# Altium schematic sheet DB_Panel.SchDoc
size Tabloid; SheetNumber: 1; SheetTotal: 1; Sheet_Name: Insert name in Document Parameters; Size: 11x17
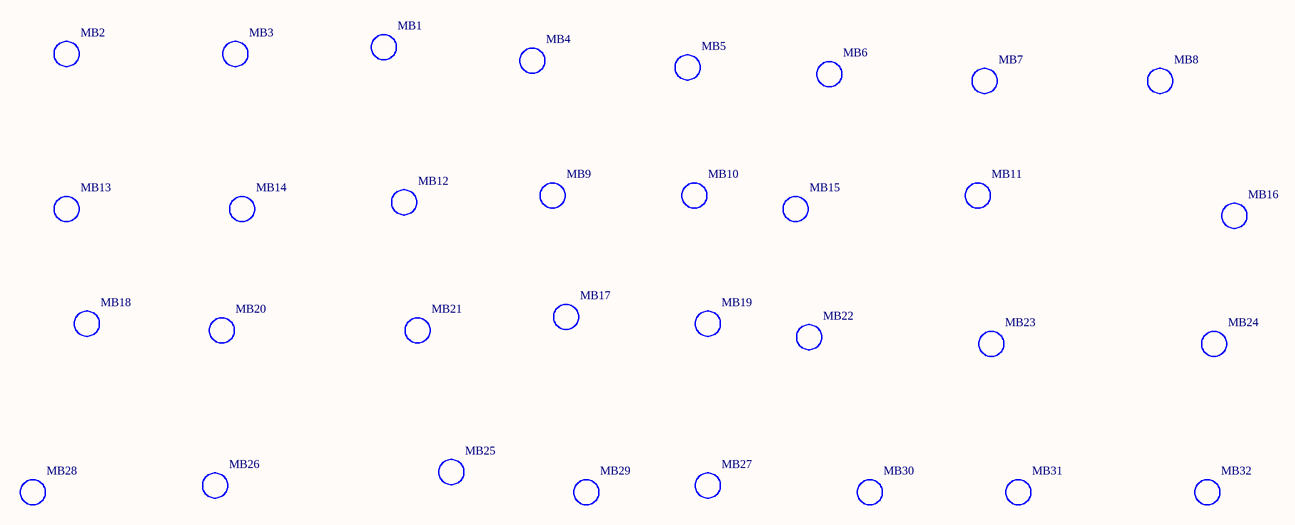
[diagram p0: DB_Panel.SchDoc]

## Parts
MB1  Part Number  [MSBITE_1.6mm]  (value not drawn)
MB2  Part Number  [MSBITE_1.6mm]  (value not drawn)
MB3  Part Number  [MSBITE_1.6mm]  (value not drawn)
MB4  Part Number  [MSBITE_1.6mm]  (value not drawn)
MB5  Part Number  [MSBITE_1.6mm]  (value not drawn)
MB6  Part Number  [MSBITE_1.6mm]  (value not drawn)
MB7  Part Number  [MSBITE_1.6mm]  (value not drawn)
MB8  Part Number  [MSBITE_1.6mm]  (value not drawn)
MB9  Part Number  [MSBITE_1.6mm]  (value not drawn)
MB10  Part Number  [MSBITE_1.6mm]  (value not drawn)
MB11  Part Number  [MSBITE_1.6mm]  (value not drawn)
MB12  Part Number  [MSBITE_1.6mm]  (value not drawn)
MB13  Part Number  [MSBITE_1.6mm]  (value not drawn)
MB14  Part Number  [MSBITE_1.6mm]  (value not drawn)
MB15  Part Number  [MSBITE_1.6mm]  (value not drawn)
MB16  Part Number  [MSBITE_1.6mm]  (value not drawn)
MB17  Part Number  [MSBITE_1.6mm]  (value not drawn)
MB18  Part Number  [MSBITE_1.6mm]  (value not drawn)
MB19  Part Number  [MSBITE_1.6mm]  (value not drawn)
MB20  Part Number  [MSBITE_1.6mm]  (value not drawn)
MB21  Part Number  [MSBITE_1.6mm]  (value not drawn)
MB22  Part Number  [MSBITE_1.6mm]  (value not drawn)
MB23  Part Number  [MSBITE_1.6mm]  (value not drawn)
MB24  Part Number  [MSBITE_1.6mm]  (value not drawn)
MB25  Part Number  [MSBITE_1.6mm]  (value not drawn)
MB26  Part Number  [MSBITE_1.6mm]  (value not drawn)
MB27  Part Number  [MSBITE_1.6mm]  (value not drawn)
MB28  Part Number  [MSBITE_1.6mm]  (value not drawn)
MB29  Part Number  [MSBITE_1.6mm]  (value not drawn)
MB30  Part Number  [MSBITE_1.6mm]  (value not drawn)
MB31  Part Number  [MSBITE_1.6mm]  (value not drawn)
MB32  Part Number  [MSBITE_1.6mm]  (value not drawn)

## Notes on the sheet
- Sheet Name
- Project Title
- Global Project
- Size
- Group
- Revision
- Date
- Sheet
- of
- Filename
- Designers

## Library data of the parts
MB1-MB32 = Mousebite: Mousebite, 0.5 mm hole 5x, 0.3 mm spacing, 1.5 mm tool route; GRAMS Lib Spec: 2.7